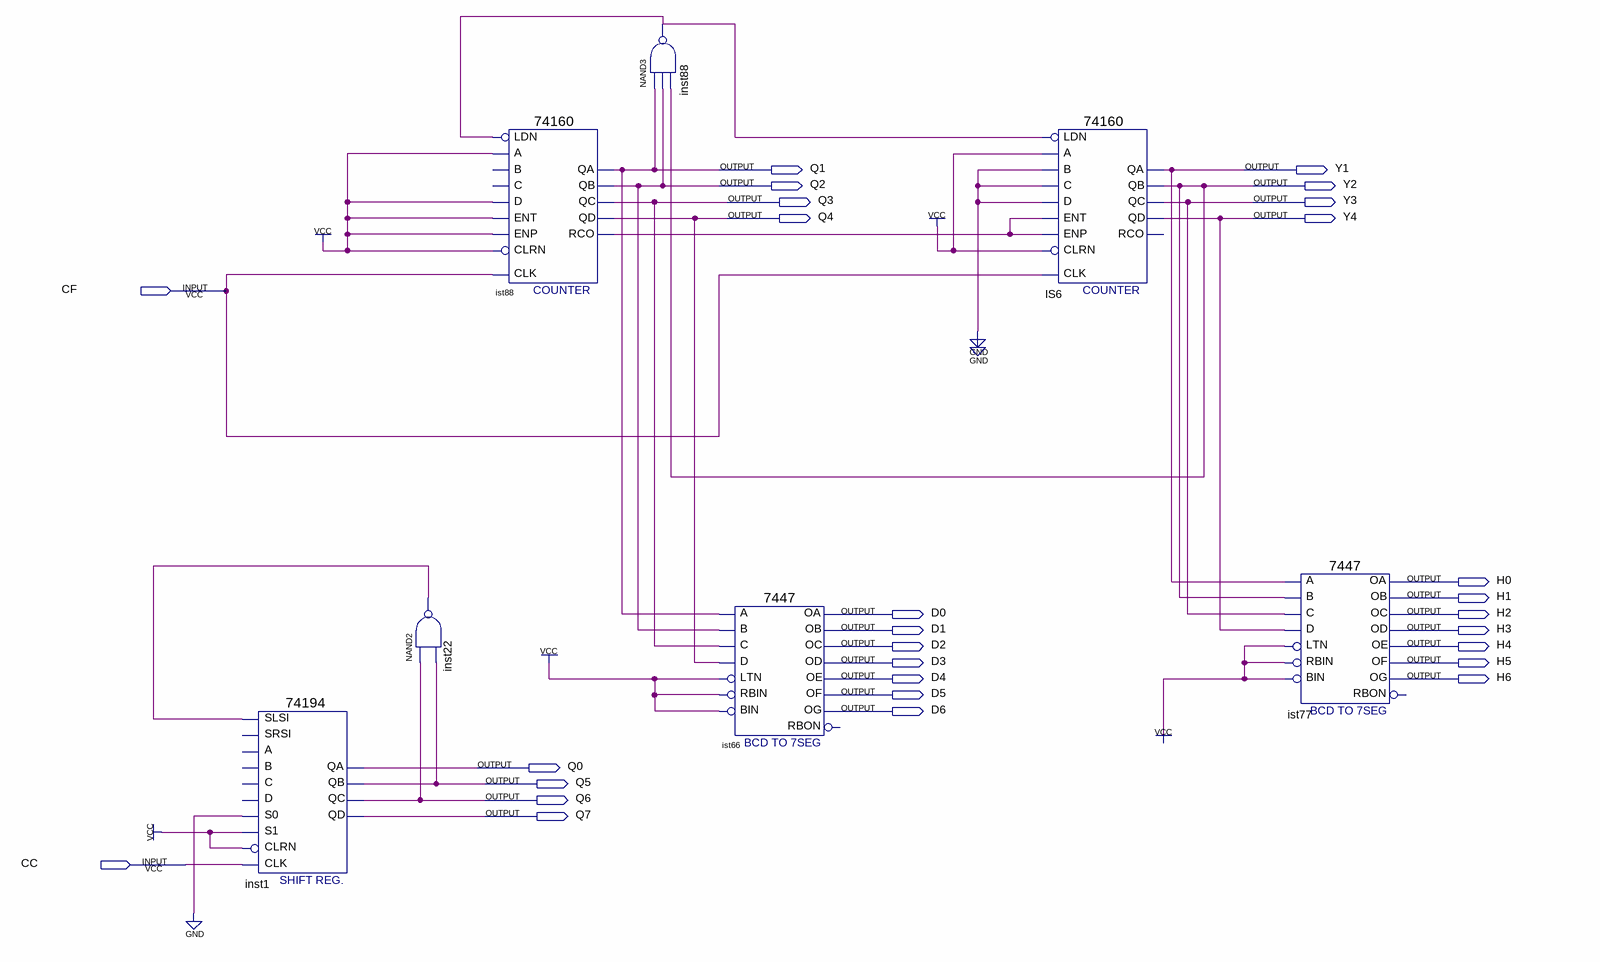
[diagram p0: schematic sheet]
// Quartus schematic 2023063114THR.bdf as structural Verilog: 7 symbols, 28 pins
module \2023063114THR  (
  input  CF,
  input  CC,
  output Q1,
  output Y1,
  output Q2,
  output Y2,
  output Q3,
  output Y3,
  output Q4,
  output Y4,
  output H0,
  output H1,
  output D0,
  output H2,
  output D1,
  output H3,
  output D2,
  output H4,
  output D3,
  output H5,
  output D4,
  output H6,
  output D5,
  output D6,
  output Q0,
  output Q5,
  output Q6,
  output Q7
);

  wire inst22_out, inst88_out, ist88_rco;

  \74194  inst1 (
    .SLSI(inst22_out), .CLK(CC), .CLRN(1'b1), .S1(1'b1), .S0(1'b0), .QA(Q0), .QB(Q5), .QC(Q6), .QD(Q7));  // open: SRSI, B, C, D, A
  nand inst22 (inst22_out, Q6, Q5);
  \74160  ist88 (
    .CLK(CF), .ENT(1'b1), .A(1'b1), .D(1'b1), .LDN(inst88_out), .ENP(1'b1), .CLRN(1'b1), .QD(Q4), .QA(Q1),
    .QB(Q2), .QC(Q3), .RCO(ist88_rco));  // open: B, C
  nand inst88 (inst88_out, Q1, Q2, Y2);
  \7447  ist66 (
    .LTN(1'b1), .B(Q2), .C(Q3), .D(Q4), .RBIN(1'b1), .BIN(1'b1), .A(Q1), .OB(D1), .OC(D2), .OE(D4), .OD(D3),
    .OF(D5), .OG(D6), .OA(D0));  // open: RBON
  \74160  IS6 (
    .CLK(CF), .ENT(ist88_rco), .A(1'b1), .B(1'b0), .C(1'b0), .D(1'b0), .LDN(inst88_out), .ENP(ist88_rco),
    .CLRN(1'b1), .QD(Y4), .QA(Y1), .QB(Y2), .QC(Y3));  // open: RCO
  \7447  ist77 (
    .LTN(1'b1), .B(Y2), .C(Y3), .D(Y4), .RBIN(1'b1), .BIN(1'b1), .A(Y1), .OB(H1), .OC(H2), .OE(H4), .OD(H3),
    .OF(H5), .OG(H6), .OA(H0));  // open: RBON
endmodule
